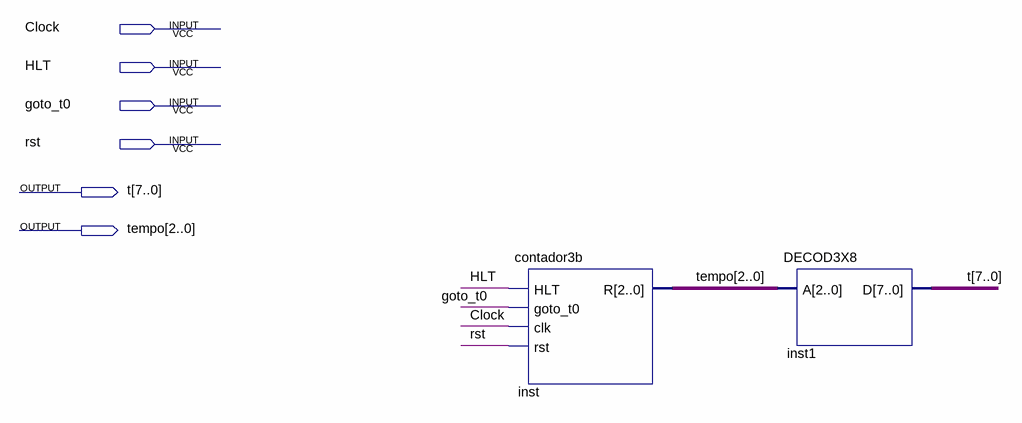
[diagram p0: schematic sheet]
// Quartus schematic temporizador.bdf as structural Verilog: 2 symbols, 6 pins
module temporizador (
  input  Clock,
  input  HLT,
  input  goto_t0,
  input  rst,
  output [7:0] t,
  output [2:0] tempo
);

  contador3b inst (.HLT(HLT), .goto_t0(goto_t0), .clk(Clock), .rst(rst), .R(tempo));
  DECOD3X8 inst1 (.A(tempo), .D(t));
endmodule
